# Altium schematic sheet GPIO-Expander.SchDoc
size A; SheetNumber: 8; SheetTotal: 9
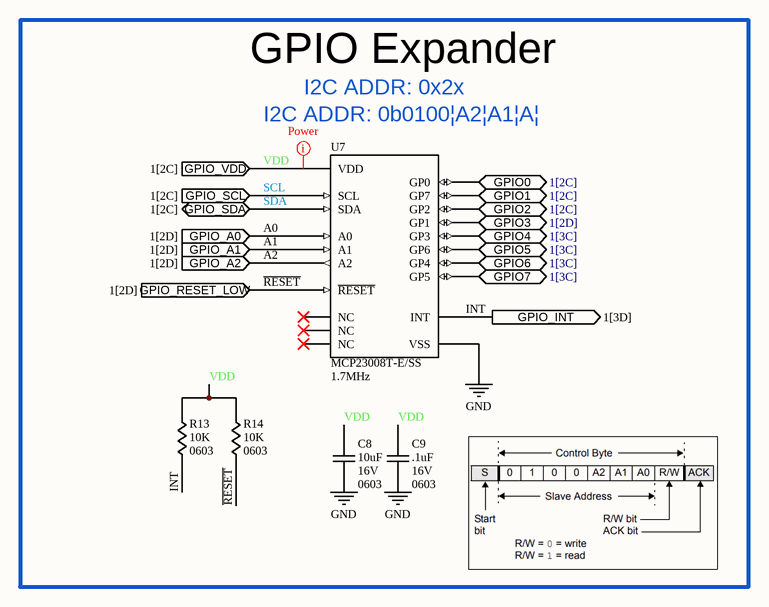
[diagram p0: GPIO-Expander.SchDoc]

## Parts
C8  value 10uF  Voltage: 16V  Footprint: 0603  [PCB-CAP-SMD-0603]  (hidden comment: CAP-SMD-0603)
C9  value .1uF  Voltage: 16V  Footprint: 0603  [PCB-CAP-SMD-0603]  (hidden comment: CAP-SMD-0603)
R13  value 10K  Footprint: 0603  [PCB-RES-SMD-0603]  (hidden comment: RES-SMD-0603)
R14  value 10K  Footprint: 0603  [PCB-RES-SMD-0603]  (hidden comment: RES-SMD-0603)
U7  Frequency: 1.7MHz  Part Number: MCP23008T-E/SS  [PCB-TSSOP-20-.65MM-7.2x5.2MM]  (hidden comment: IC-GPIO-EXPANDER-I2C-8CH-MCP23008T-E/SS)

## Ports
GPIO0 (bidir, see 1[2C]), GPIO1 (bidir, see 1[2C]), GPIO2 (bidir, see 1[2C]), GPIO3 (bidir, see 1[2D]), GPIO4 (bidir, see 1[3C]), GPIO5 (bidir, see 1[3C]), GPIO6 (bidir, see 1[3C]), GPIO7 (bidir, see 1[3C]), GPIO_A0 (in, see 1[2D]), GPIO_A1 (in, see 1[2D]), GPIO_A2 (in, see 1[2D]), GPIO_INT (out, see 1[3D]), GPIO_RESET_LOW (in, see 1[2D]), GPIO_SCL (in, see 1[2C]), GPIO_SDA (bidir, see 1[2C]), GPIO_VDD (in, see 1[2C])

## Nets
GND: C8.1 C9.1 U7.9(VSS)
A0: U7.5(A0) ; port GPIO_A0
A1: U7.4(A1) ; port GPIO_A1
A2: U7.3(A2) ; port GPIO_A2
GPIO0: U7.12(GP0) ; port GPIO0
GPIO1: U7.19(GP7) ; port GPIO1
GPIO2: U7.14(GP2) ; port GPIO2
GPIO3: U7.13(GP1) ; port GPIO3
GPIO4: U7.15(GP3) ; port GPIO4
GPIO5: U7.18(GP6) ; port GPIO5
GPIO6: U7.16(GP4) ; port GPIO6
GPIO7: U7.17(GP5) ; port GPIO7
INT: R13.1 U7.8(INT) ; port GPIO_INT
~{RESET}: R14.1 U7.6(~{RESET}) ; port GPIO_RESET_LOW
SCL: U7.1(SCL) ; port GPIO_SCL
SDA: U7.2(SDA) ; port GPIO_SDA
VDD: C8.2 C9.2 R13.2 R14.2 U7.20(VDD) ; port GPIO_VDD

Not connected (* = marked no-connect by the designer): U7 7(NC)* 10(NC)* 11(NC)*

## Layout directives
net class Power: VDD

## Notes on the sheet
- GPIO Expander
- I2C ADDR: 0x2x
- (near U7) I2C ADDR: 0b0100|A2|A1|A|

## Library data of the parts
C8 C9 = CMP-00006-5: Generic (no part number) 0603 surface mount capacitor
R13 R14 = CMP-00002-4: Generic (no part number) 0603 surface mount resistor
U7 = CMP-00069-3: MCP23008 Series 5.5 V 1.7 MHz 8-Bit I/O Expander with Serial Interface - SSOP-20; Interface: I2C,Serial; Operating Supply Voltage: 5.5V; Power Dissipation: 700mW; Supply Current: 1mA; Output Type: PUSH-PULL; Number of I/Os: 8; Number of Channels: 1; Lead Free: Lead Free; Package Quantity: 1600; Series: -; Case/Package: SSOP; Pins: 20; Min Operating Temperature: -40°C; RoHS Compliant: Yes; Nominal Supply Voltage: 5.5V; Packaging: Tape and Reel; Max Operating Temperature: 125°C; Clock Frequency: 1.7MHz